# EAGLE schematic driver (EAGLE 9.4.2)
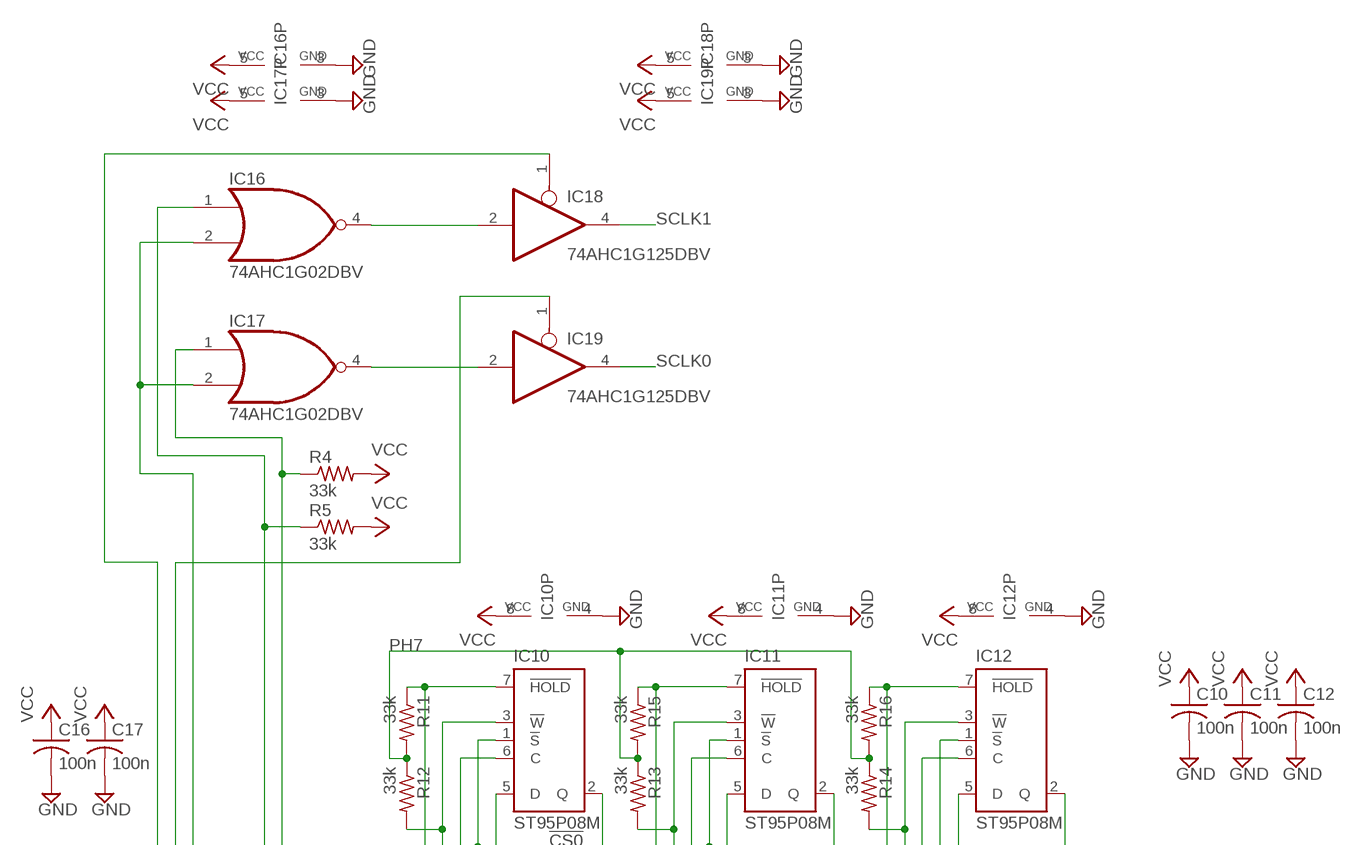
[diagram p0: schematic, sheet 1, part 1 of 2]
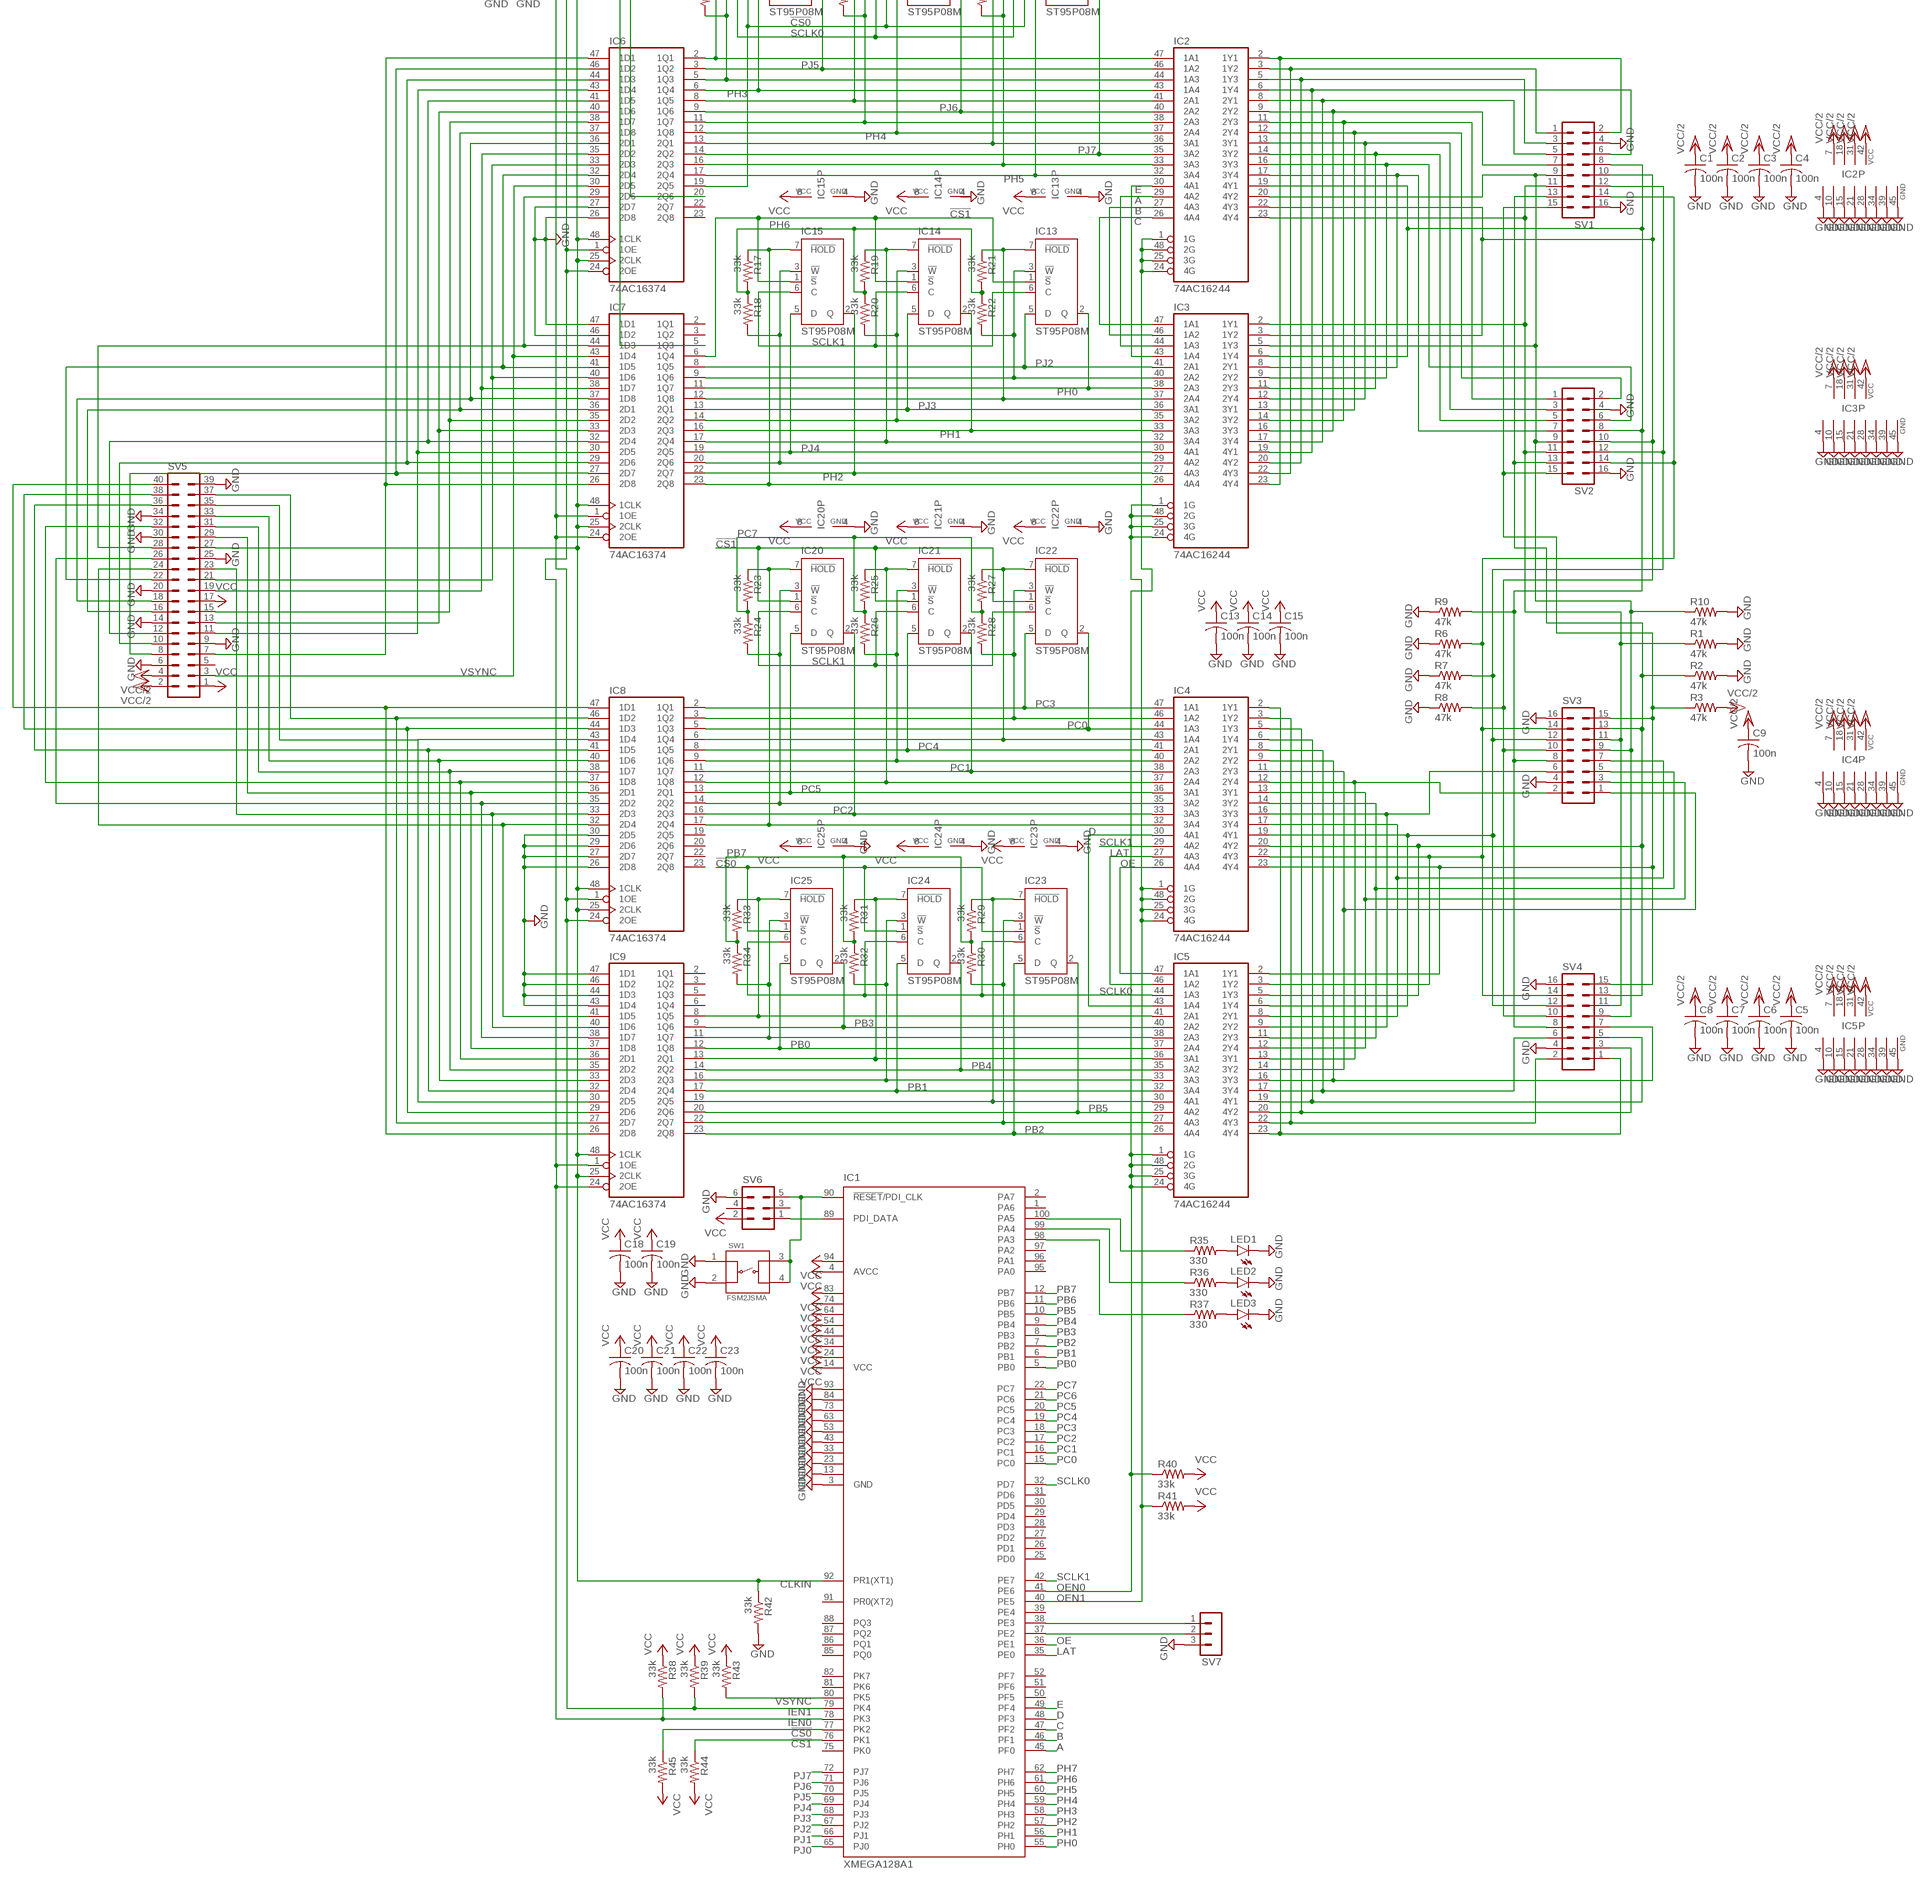
[diagram p1: schematic, sheet 1, part 2 of 2]

## Parts
C1  100n  C-USC0402  [C0402]
C2  100n  C-USC0402  [C0402]
C3  100n  C-USC0402  [C0402]
C4  100n  C-USC0402  [C0402]
C5  100n  C-USC0402  [C0402]
C6  100n  C-USC0402  [C0402]
C7  100n  C-USC0402  [C0402]
C8  100n  C-USC0402  [C0402]
C9  100n  C-USC0402  [C0402]
C10  100n  C-USC0402  [C0402]
C11  100n  C-USC0402  [C0402]
C12  100n  C-USC0402  [C0402]
C13  100n  C-USC0402  [C0402]
C14  100n  C-USC0402  [C0402]
C15  100n  C-USC0402  [C0402]
C16  100n  C-USC0402  [C0402]
C17  100n  C-USC0402  [C0402]
C18  100n  C-USC0402  [C0402]
C19  100n  C-USC0402  [C0402]
C20  100n  C-USC0402  [C0402]
C21  100n  C-USC0402  [C0402]
C22  100n  C-USC0402  [C0402]
C23  100n  C-USC0402  [C0402]
IC1  XMEGA128A1  [TQFP100]
IC2  74AC16244  [SSOP48DL]
IC3  74AC16244  [SSOP48DL]
IC4  74AC16244  [SSOP48DL]
IC5  74AC16244  [SSOP48DL]
IC6  74AC16374  [SSOP48DL]
IC7  74AC16374  [SSOP48DL]
IC8  74AC16374  [SSOP48DL]
IC9  74AC16374  [SSOP48DL]
IC10  ST95P08M  [SO08]
IC11  ST95P08M  [SO08]
IC12  ST95P08M  [SO08]
IC13  ST95P08M  [SO08]
IC14  ST95P08M  [SO08]
IC15  ST95P08M  [SO08]
IC16  74AHC1G02DBV  [SOT23-5]
IC17  74AHC1G02DBV  [SOT23-5]
IC18  74AHC1G125DBV  [SOT23-5]
IC19  74AHC1G125DBV  [SOT23-5]
IC20  ST95P08M  [SO08]
IC21  ST95P08M  [SO08]
IC22  ST95P08M  [SO08]
IC23  ST95P08M  [SO08]
IC24  ST95P08M  [SO08]
IC25  ST95P08M  [SO08]
LED1  LEDCHIPLED_0805  [CHIPLED_0805]
LED2  LEDCHIPLED_0805  [CHIPLED_0805]
LED3  LEDCHIPLED_0805  [CHIPLED_0805]
R1  47k  R-US_R0402  [R0402]
R2  47k  R-US_R0402  [R0402]
R3  47k  R-US_R0402  [R0402]
R4  33k  R-US_R0402  [R0402]
R5  33k  R-US_R0402  [R0402]
R6  47k  R-US_R0402  [R0402]
R7  47k  R-US_R0402  [R0402]
R8  47k  R-US_R0402  [R0402]
R9  47k  R-US_R0402  [R0402]
R10  47k  R-US_R0402  [R0402]
R11  33k  R-US_R0402  [R0402]
R12  33k  R-US_R0402  [R0402]
R13  33k  R-US_R0402  [R0402]
R14  33k  R-US_R0402  [R0402]
R15  33k  R-US_R0402  [R0402]
R16  33k  R-US_R0402  [R0402]
R17  33k  R-US_R0402  [R0402]
R18  33k  R-US_R0402  [R0402]
R19  33k  R-US_R0402  [R0402]
R20  33k  R-US_R0402  [R0402]
R21  33k  R-US_R0402  [R0402]
R22  33k  R-US_R0402  [R0402]
R23  33k  R-US_R0402  [R0402]
R24  33k  R-US_R0402  [R0402]
R25  33k  R-US_R0402  [R0402]
R26  33k  R-US_R0402  [R0402]
R27  33k  R-US_R0402  [R0402]
R28  33k  R-US_R0402  [R0402]
R29  33k  R-US_R0402  [R0402]
R30  33k  R-US_R0402  [R0402]
R31  33k  R-US_R0402  [R0402]
R32  33k  R-US_R0402  [R0402]
R33  33k  R-US_R0402  [R0402]
R34  33k  R-US_R0402  [R0402]
R35  330  R-US_R0402  [R0402]
R36  330  R-US_R0402  [R0402]
R37  330  R-US_R0402  [R0402]
R38  33k  R-US_R0402  [R0402]
R39  33k  R-US_R0402  [R0402]
R40  33k  R-US_R0402  [R0402]
R41  33k  R-US_R0402  [R0402]
R42  33k  R-US_R0402  [R0402]
R43  33k  R-US_R0402  [R0402]
R44  33k  R-US_R0402  [R0402]
R45  33k  R-US_R0402  [R0402]
SV1  MA08-2  [MA08-2]
SV2  MA08-2  [MA08-2]
SV3  MA08-2  [MA08-2]
SV4  MA08-2  [MA08-2]
SV5  MA20-2  [MA20-2]
SV6  MA03-2  [MA03-2]
SV7  MA03-1  [MA03-1]
SW1  FSM2JSMA  [FSM2JSMA]

## Nets
!CS0: IC1.77(PK2) IC6.19(2Q5) IC10.1(!S) IC11.1(!S) IC12.1(!S) IC23.1(!S) IC24.1(!S) IC25.1(!S) R45.1
!CS1: IC1.76(PK1) IC7.6(1Q4) IC13.1(!S) IC14.1(!S) IC15.1(!S) IC20.1(!S) IC21.1(!S) IC22.1(!S) R44.1
A: IC1.45(PF0) IC2.29(4A2) IC3.44(1A3)
B: IC1.46(PF1) IC2.27(4A3) IC3.46(1A2)
C: IC1.47(PF2) IC2.26(4A4) IC3.47(1A1)
CLKIN: IC1.92(PR1(XT1)) IC6.25(2CLK) IC6.48(1CLK) IC7.25(2CLK) IC7.48(1CLK) IC8.25(2CLK) IC8.48(1CLK) IC9.25(2CLK) IC9.48(1CLK) IC16.2(I1) IC17.2(I1) R42.1 SV5.27
D: IC1.48(PF3) IC4.30(4A1) IC5.43(1A4)
E: IC1.49(PF4) IC2.30(4A1) IC3.43(1A4)
GND: C1.2 C2.2 C3.2 C4.2 C5.2 C6.2 C7.2 C8.2 C9.2 C10.2 C11.2 C12.2 C13.2 C14.2 C15.2 C16.2 C17.2 C18.2 C19.2 C20.2 C21.2 C22.2 C23.2 IC1.3(GND) IC1.13(GND1) IC1.23(GND2) IC1.33(GND3) IC1.43(GND4) IC1.53(GND5) IC1.63(GND6) IC1.73(GND7) IC1.84(GND8) IC1.93(GND9) IC2.4(GND) IC2.10(GND) IC2.15(GND) IC2.21(GND) IC2.28(GND) IC2.34(GND) IC2.39(GND) IC2.45(GND) IC3.4(GND) IC3.10(GND) IC3.15(GND) IC3.21(GND) IC3.28(GND) IC3.34(GND) IC3.39(GND) IC3.45(GND) IC4.4(GND) IC4.10(GND) IC4.15(GND) IC4.21(GND) IC4.28(GND) IC4.34(GND) IC4.39(GND) IC4.45(GND) IC5.4(GND) IC5.10(GND) IC5.15(GND) IC5.21(GND) IC5.28(GND) IC5.34(GND) IC5.39(GND) IC5.45(GND) IC6.26(2D8) IC6.27(2D7) IC7.46(1D2) IC7.47(1D1) IC8.26(2D8) IC8.27(2D7) IC8.29(2D6) IC8.30(2D5) IC9.43(1D4) IC9.44(1D3) IC9.46(1D2) IC9.47(1D1) IC10.4(GND) IC11.4(GND) IC12.4(GND) IC13.4(GND) IC15.4(GND) IC16.3(GND) IC17.3(GND) IC18.3(GND) IC19.3(GND) IC20.4(GND) IC21.4(GND) IC22.4(GND) IC23.4(GND) IC24.4(GND) IC25.4(GND) LED1.C LED2.C LED3.C R1.2 R2.2 R6.1 R7.1 R8.1 R9.1 R10.2 R42.2 SV1.4 SV1.16 SV2.4 SV2.16 SV3.4 SV3.16 SV4.4 SV4.16 SV5.6 SV5.9 SV5.14 SV5.20 SV5.25 SV5.30 SV5.34 SV5.39 SV6.6 SV7.3 SW1.1 SW1.2
IEN0: IC1.78(PK3) IC6.1(1OE) IC6.24(2OE) IC9.1(1OE) IC9.24(2OE) IC19.1(OE) R38.2
IEN1: IC1.79(PK4) IC7.1(1OE) IC7.24(2OE) IC8.1(1OE) IC8.24(2OE) IC18.1(OE) R39.2
LAT: IC1.35(PE0) IC4.27(4A3) IC5.46(1A2)
N$1: IC2.2(1Y1) IC3.23(4Y4) SV1.2
N$2: IC2.3(1Y2) IC3.22(4Y3) SV1.1
N$3: IC2.6(1Y4) IC3.19(4Y1) SV1.6
N$4: IC2.5(1Y3) IC3.20(4Y2) SV1.3
N$5: IC2.8(2Y1) IC3.17(3Y4) SV1.5
N$6: IC2.9(2Y2) IC3.16(3Y3) SV1.7
N$7: IC2.12(2Y4) IC3.13(3Y1) SV2.2
N$8: IC2.14(3Y2) IC3.11(2Y3) SV2.5
N$9: IC2.13(3Y1) IC3.12(2Y4) SV2.3
N$10: IC2.16(3Y3) IC3.9(2Y2) SV2.6
N$11: IC2.19(4Y1) IC3.6(1Y4) R9.2 SV1.8 SV2.8 SV3.8 SV4.8
N$12: IC2.20(4Y2) IC3.5(1Y3) R10.1 SV1.9 SV2.9 SV3.9 SV4.9
N$13: IC2.11(2Y3) IC3.14(3Y2) SV2.1
N$14: IC2.23(4Y4) IC3.2(1Y1) R1.1 SV1.11 SV2.11 SV3.11 SV4.11
N$15: IC2.22(4Y3) IC3.3(1Y2) R8.2 SV1.10 SV2.10 SV3.10 SV4.10
N$17: IC4.19(4Y1) IC5.6(1Y4) R7.2 SV1.12 SV2.12 SV3.12 SV4.12
N$18: IC2.17(3Y4) IC3.8(2Y1) SV2.7
N$20: IC4.20(4Y2) IC5.5(1Y3) R2.1 SV1.13 SV2.13 SV3.13 SV4.13
N$21: IC4.23(4Y4) IC5.2(1Y1) R3.1 SV1.15 SV2.15 SV3.15 SV4.15
N$22: IC4.3(1Y2) IC5.22(4Y3) SV4.2
N$23: IC4.2(1Y1) IC5.23(4Y4) SV4.1
N$24: IC4.5(1Y3) IC5.20(4Y2) SV4.3
N$25: IC4.6(1Y4) IC5.19(4Y1) SV4.5
N$26: IC4.8(2Y1) IC5.17(3Y4) SV4.6
N$27: IC4.22(4Y3) IC5.3(1Y2) R6.2 SV1.14 SV2.14 SV3.14 SV4.14
N$28: IC4.9(2Y2) IC5.16(3Y3) SV4.7
N$29: IC2.47(1A1) IC6.2(1Q1) IC10.7(!HOLD) R11.1
N$30: IC6.32(2D4) IC7.41(1D5) SV5.22
N$31: IC2.44(1A3) IC6.5(1Q3) IC10.3(!W) R12.2
N$32: IC4.11(2Y3) IC5.14(3Y2) SV3.1
N$33: IC4.12(2Y4) IC5.13(3Y1) SV3.2
N$34: IC6.33(2D3) IC7.40(1D6) SV5.21
N$35: IC2.41(2A1) IC6.8(1Q5) IC11.7(!HOLD) R15.1
N$36: IC4.13(3Y1) IC5.12(2Y4) SV3.3
N$37: IC4.14(3Y2) IC5.11(2Y3) SV3.5
N$38: IC4.16(3Y3) IC5.9(2Y2) SV3.6
N$39: IC4.17(3Y4) IC5.8(2Y1) SV3.7
N$40: IC6.35(2D2) IC7.38(1D7) SV5.19
N$41: IC2.38(2A3) IC6.11(1Q7) IC11.3(!W) R13.2
N$42: IC16.4(O) IC18.2(I)
N$43: IC2.36(3A1) IC6.13(2Q1) IC12.7(!HOLD) R16.1
N$44: IC6.36(2D1) IC7.37(1D8) SV5.18
N$45: IC2.33(3A3) IC6.16(2Q3) IC12.3(!W) R14.2
N$46: IC17.4(O) IC19.2(I)
N$47: IC3.26(4A4) IC7.23(2Q8) IC15.7(!HOLD) R17.1
N$49: IC3.29(4A2) IC7.20(2Q6) IC15.3(!W) R18.2
N$50: IC6.37(1D8) IC7.36(2D1) SV5.16
N$51: IC3.32(3A4) IC7.17(2Q4) IC14.7(!HOLD) R19.1
N$52: IC6.38(1D7) IC7.35(2D2) SV5.15
N$53: IC3.35(3A2) IC7.14(2Q2) IC14.3(!W) R20.2
N$54: IC6.40(1D6) IC7.33(2D3) SV5.13
N$55: IC3.37(2A4) IC7.12(1Q8) IC13.7(!HOLD) R21.1
N$57: IC3.40(2A2) IC7.9(1Q6) IC13.3(!W) R22.2
N$58: IC6.41(1D5) IC7.32(2D4) SV5.12
N$59: IC6.43(1D4) IC7.30(2D5) SV5.11
N$60: IC6.44(1D3) IC7.29(2D6) SV5.10
N$61: IC6.46(1D2) IC7.27(2D7) SV5.8
N$62: IC6.47(1D1) IC7.26(2D8) SV5.7
N$63: IC1.90(!RESET!/PDI_CLK) SV6.5 SW1.3 SW1.4
N$64: IC4.46(1A2) IC8.3(1Q2) IC22.3(!W) R28.2
N$65: IC4.43(1A4) IC8.6(1Q4) IC22.7(!HOLD) R27.1
N$66: LED3.A R37.2
N$67: LED2.A R36.2
N$68: IC4.40(2A2) IC8.9(1Q6) IC21.3(!W) R26.2
N$69: LED1.A R35.2
N$70: IC4.37(2A4) IC8.12(1Q8) IC21.7(!HOLD) R25.1
N$71: IC1.100(PA5) R35.1
N$72: IC4.35(3A2) IC8.14(2Q2) IC20.3(!W) R24.2
N$73: IC1.99(PA4) R36.1
N$74: IC4.32(3A4) IC8.17(2Q4) IC20.7(!HOLD) R23.1
N$75: IC1.98(PA3) R37.1
N$76: IC5.27(4A3) IC9.22(2Q7) IC23.3(!W) R30.2
N$78: IC5.30(4A1) IC9.19(2Q5) IC23.7(!HOLD) R29.1
N$80: IC5.33(3A3) IC9.16(2Q3) IC24.3(!W) R32.2
N$82: IC5.36(3A1) IC9.13(2Q1) IC24.7(!HOLD) R31.1
N$84: IC5.38(2A3) IC9.11(1Q7) IC25.3(!W) R34.2
N$86: IC5.41(2A1) IC9.8(1Q5) IC25.7(!HOLD) R33.1
N$87: IC1.89(PDI_DATA) SV6.1
N$89: IC1.38(PE3) SV7.1
N$90: IC1.37(PE2) SV7.2
N$91: IC8.32(2D4) IC9.41(1D5) SV5.24
N$93: IC6.29(2D6) IC7.44(1D3) SV5.28
N$95: IC8.33(2D3) IC9.40(1D6) SV5.23
N$96: IC8.35(2D2) IC9.38(1D7) SV5.26
N$97: IC8.36(2D1) IC9.37(1D8) SV5.29
N$98: IC8.37(1D8) IC9.36(2D1) SV5.32
N$102: IC8.38(1D7) IC9.35(2D2) SV5.31
N$106: IC8.40(1D6) IC9.33(2D3) SV5.33
N$108: IC8.43(1D4) IC9.30(2D5) SV5.35
N$109: IC8.44(1D3) IC9.29(2D6) SV5.38
N$110: IC6.20(2Q6) IC17.1(I0) R4.1
N$111: IC8.46(1D2) IC9.27(2D7) SV5.37
N$112: IC8.47(1D1) IC9.26(2D8) SV5.40
N$113: IC7.5(1Q3) IC16.1(I0) R5.1
N$118: IC8.41(1D5) IC9.32(2D4) SV5.36
OE: IC1.36(PE1) IC4.26(4A4) IC5.47(1A1)
OEN0: IC1.41(PE6) IC2.1(1G) IC2.24(4G) IC2.25(3G) IC2.48(2G) IC5.1(1G) IC5.24(4G) IC5.25(3G) IC5.48(2G) R40.1
OEN1: IC1.40(PE5) IC3.1(1G) IC3.24(4G) IC3.25(3G) IC3.48(2G) IC4.1(1G) IC4.24(4G) IC4.25(3G) IC4.48(2G) R41.1
PB0: IC1.5(PB0) IC5.37(2A4) IC9.12(1Q8) IC25.5(D)
PB1: IC1.6(PB1) IC5.32(3A4) IC9.17(2Q4) IC24.5(D)
PB2: IC1.7(PB2) IC5.26(4A4) IC9.23(2Q8) IC23.5(D)
PB3: IC1.8(PB3) IC5.40(2A2) IC9.9(1Q6) IC25.2(Q)
PB4: IC1.9(PB4) IC5.35(3A2) IC9.14(2Q2) IC24.2(Q)
PB5: IC1.10(PB5) IC5.29(4A2) IC9.20(2Q6) IC23.2(Q)
PB6: IC1.11(PB6)
PB7: IC1.12(PB7) R29.2 R30.1 R31.2 R32.1 R33.2 R34.1
PC0: IC1.15(PC0) IC4.44(1A3) IC8.5(1Q3) IC22.2(Q)
PC1: IC1.16(PC1) IC4.38(2A3) IC8.11(1Q7) IC21.2(Q)
PC2: IC1.17(PC2) IC4.33(3A3) IC8.16(2Q3) IC20.2(Q)
PC3: IC1.18(PC3) IC4.47(1A1) IC8.2(1Q1) IC22.5(D)
PC4: IC1.19(PC4) IC4.41(2A1) IC8.8(1Q5) IC21.5(D)
PC5: IC1.20(PC5) IC4.36(3A1) IC8.13(2Q1) IC20.5(D)
PC6: IC1.21(PC6)
PC7: IC1.22(PC7) R23.2 R24.1 R25.2 R26.1 R27.2 R28.1
PH0: IC1.55(PH0) IC3.38(2A3) IC7.11(1Q7) IC13.2(Q)
PH1: IC1.56(PH1) IC3.33(3A3) IC7.16(2Q3) IC14.2(Q)
PH2: IC1.57(PH2) IC3.27(4A3) IC7.22(2Q7) IC15.2(Q)
PH3: IC1.58(PH3) IC2.43(1A4) IC6.6(1Q4) IC10.5(D)
PH4: IC1.59(PH4) IC2.37(2A4) IC6.12(1Q8) IC11.5(D)
PH5: IC1.60(PH5) IC2.32(3A4) IC6.17(2Q4) IC12.5(D)
PH6: IC1.61(PH6) R17.2 R18.1 R19.2 R20.1 R21.2 R22.1
PH7: IC1.62(PH7) R11.2 R12.1 R13.1 R14.1 R15.2 R16.2
PJ0: IC1.65(PJ0)
PJ1: IC1.66(PJ1)
PJ2: IC1.67(PJ2) IC3.41(2A1) IC7.8(1Q5) IC13.5(D)
PJ3: IC1.68(PJ3) IC3.36(3A1) IC7.13(2Q1) IC14.5(D)
PJ4: IC1.69(PJ4) IC3.30(4A1) IC7.19(2Q5) IC15.5(D)
PJ5: IC1.70(PJ5) IC2.46(1A2) IC6.3(1Q2) IC10.2(Q)
PJ6: IC1.71(PJ6) IC2.40(2A2) IC6.9(1Q6) IC11.2(Q)
PJ7: IC1.72(PJ7) IC2.35(3A2) IC6.14(2Q2) IC12.2(Q)
SCLK0: IC1.32(PD7) IC5.44(1A3) IC10.6(C) IC11.6(C) IC12.6(C) IC19.4(O) IC23.6(C) IC24.6(C) IC25.6(C)
SCLK1: IC1.42(PE7) IC4.29(4A2) IC13.6(C) IC14.6(C) IC15.6(C) IC18.4(O) IC20.6(C) IC21.6(C) IC22.6(C)
VCC: C10.1 C11.1 C12.1 C13.1 C14.1 C15.1 C16.1 C17.1 C18.1 C19.1 C20.1 C21.1 C22.1 C23.1 IC1.4(AVCC) IC1.14(VCC) IC1.24(VCC1) IC1.34(VCC2) IC1.44(VCC3) IC1.54(VCC4) IC1.64(VCC5) IC1.74(VCC6) IC1.83(VCC7) IC1.94(AVCC1) IC10.8(VCC) IC11.8(VCC) IC12.8(VCC) IC13.8(VCC) IC14.8(VCC) IC15.8(VCC) IC16.5(VCC) IC17.5(VCC) IC18.5(VCC) IC19.5(VCC) IC20.8(VCC) IC21.8(VCC) IC22.8(VCC) IC23.8(VCC) IC24.8(VCC) IC25.8(VCC) R4.2 R5.2 R38.1 R39.1 R40.2 R41.2 R43.1 R44.2 R45.2 SV5.1 SV5.17 SV6.2
VCC/2: C1.1 C2.1 C3.1 C4.1 C5.1 C6.1 C7.1 C8.1 C9.1 IC2.7(VCC) IC2.18(VCC) IC2.31(VCC) IC2.42(VCC) IC3.7(VCC) IC3.18(VCC) IC3.31(VCC) IC3.42(VCC) IC4.7(VCC) IC4.18(VCC) IC4.31(VCC) IC4.42(VCC) IC5.7(VCC) IC5.18(VCC) IC5.31(VCC) IC5.42(VCC) R3.2 SV5.2 SV5.4
VSYNC: IC1.80(PK5) IC6.30(2D5) IC7.43(1D4) R43.2 SV5.3
Unconnected: IC1.1(PA6) IC1.2(PA7) IC1.25(PD0) IC1.26(PD1) IC1.27(PD2) IC1.28(PD3) IC1.29(PD4) IC1.30(PD5) IC1.31(PD6) IC1.39(PE4) IC1.50(PF5) IC1.51(PF6) IC1.52(PF7) IC1.75(PK0) IC1.81(PK6) IC1.82(PK7) IC1.85(PQ0) IC1.86(PQ1) IC1.87(PQ2) IC1.88(PQ3) IC1.91(PR0(XT2)) IC1.95(PA0) IC1.96(PA1) IC1.97(PA2) IC6.22(2Q7) IC6.23(2Q8) IC7.2(1Q1) IC7.3(1Q2) IC8.19(2Q5) IC8.20(2Q6) IC8.22(2Q7) IC8.23(2Q8) IC9.2(1Q1) IC9.3(1Q2) IC9.5(1Q3) IC9.6(1Q4) SV5.5 SV6.3 SV6.4

## Power pins joined to a net without a drawn wire
GND: IC6.4(GND) IC6.10(GND) IC6.15(GND) IC6.21(GND) IC6.28(GND) IC6.34(GND) IC6.39(GND) IC6.45(GND) IC7.4(GND) IC7.10(GND) IC7.15(GND) IC7.21(GND) IC7.28(GND) IC7.34(GND) IC7.39(GND) IC7.45(GND) IC8.4(GND) IC8.10(GND) IC8.15(GND) IC8.21(GND) IC8.28(GND) IC8.34(GND) IC8.39(GND) IC8.45(GND) IC9.4(GND) IC9.10(GND) IC9.15(GND) IC9.21(GND) IC9.28(GND) IC9.34(GND) IC9.39(GND) IC9.45(GND) IC14.4(GND)
VCC: IC6.7(VCC) IC6.18(VCC) IC6.31(VCC) IC6.42(VCC) IC7.7(VCC) IC7.18(VCC) IC7.31(VCC) IC7.42(VCC) IC8.7(VCC) IC8.18(VCC) IC8.31(VCC) IC8.42(VCC) IC9.7(VCC) IC9.18(VCC) IC9.31(VCC) IC9.42(VCC)

## Library data of the parts
C1-C23 = rcl:C-US: CAPACITOR, American symbol; SPICEPREFIX: C
IC1 = atmel:XMEGA128A1: MICROCONTROLLER Features High-performance, Low-power 8/16-bit AVR XMEGA Microcontroller Non-Volatile Program and Data Memories - 64K - 384K Bytes of In-System Self-Programmable Flash - 4K - 8K Bytes Boot Section with Independent Lock Bits - 2 KB - 4 KB EEPROM - 4 KB - 32 KB Internal SRAM External Bus Interface for up to 16M bytes SRAM External Bus Interface for up to 128M bit SDRAM Peripheral Features - Four-channel DMA Controller with support for external requests - Eight-channel Event System - Eight 16-bit Timer/Counters Four Timer/Counters with 4 Output Compare or Input Capture channels Four Timer/Counters with 2 Output Compare or Input Capture channels High-Resolution Extension on all Timer/Counters Advanced Waveform Extension on two Timer/Counters - Eight USARTs IrDA modulation/demodulation for one USART - Four Two-Wire Interfaces with dual address match (I2C and SMBus compatible) - Four SPI (Serial Peripheral Interface) peripherals - AES and DES Crypto Engine - 16-bit Real Time Counter with separate Oscillator - Two Eight-channel, 12-bit, 2 Msps Analog to Digital Converters - Two Two-channel, 12-bit, 1 Msps Digital to Analog Converters - Four Analog Comparators with Window compare function - External Interrupts on all General Purpose I/O pins - Programmable Watchdog Timer with Separate On-chip Ultra Low Power Oscillator Special Microcontroller Features - Power-on Reset and Programmable Brown-out Detection - Internal and External Clock Options with PLL and Prescaler - Programmable Multi-level Interrupt Controller - Sleep Modes: Idle, Power-down, Standby, Power-save, Extended Standby - Advanced Programming, Test and Debugging Interfaces JTAG (IEEE 1149.1 Compliant) Interface for programming, test and debugging PDI (Program and Debug Interface) for programming and debugging I/O and Packages - 78 Programmable I/O Lines - 100 - lead TQFP - 100 - ball CBGA - 100 - ball VFBGA Operating Voltage - 1.6 - 3.6V Speed performance - 0 - 12 MHz @ 1.6 - 3.6V - 0 - 32 MHz @ 2.7 - 3.6V Drawn by Dipl.-Ing. (FH) Robert Siegler Created: 27.05.09; OC_FARNELL: unknown; OC_NEWARK: unknown
IC2-IC5 = 74ac-logic:74AC16244: 16-bit BUFFER/LINE DRIVER, 3-state
IC6-IC9 = 74ac-logic:74AC16374: 16-bit edge-triggered D-type FLIP FLOP, 3-state
IC10-IC15 IC20-IC25 = st-microelectronics:ST95P08M: Serial EEPROM SPI bus, 1 K x 8; OC_FARNELL: unknown; OC_NEWARK: unknown
IC16 IC17 = 74xx-little-us:74*1G02: 2-input NOR gate
IC18 IC19 = 74xx-little-us:74*1G125: Single Bus Buffer Gate with 3-State Output
LED1-LED3 = led:LED: LED OSRAM: - CHIPLED LG R971, LG N971, LY N971, LG Q971, LY Q971, LO R971, LY R971 LH N974, LH R974 LS Q976, LO Q976, LY Q976 LO Q996 - Hyper CHIPLED LW Q18S LB Q993, LB Q99A, LB R99A - SideLED LS A670, LO A670, LY A670, LG A670, LP A670 LB A673, LV A673, LT A673, LW A673 LH A674 LY A675 LS A676, LA A676, LO A676, LY A676, LW A676 LS A679, LY A679, LG A679 - Hyper Micro SIDELED® LS Y876, LA Y876, LO Y876, LY Y876 LT Y87S - SmartLED LW L88C, LW L88S LB L89C, LB L89S, LG L890 LS L89K, LO L89K, LY L89K LS L896, LA L896, LO L896, LY L896 - TOPLED LS T670, LO T670, LY T670, LG T670, LP T670 LSG T670, LSP T670, LSY T670, LOP T670, LYG T670 LG T671, LOG T671, LSG T671 LB T673, LV T673, LT T673, LW T673 LH T674 LS T676, LA T676, LO T676, LY T676, LB T676, LH T676, LSB T676, LW T676 LB T67C, LV T67C, LT T67C, LS T67K, LO T67K, LY T67K, LW E67C LS E67B, LA E67B, LO E67B, LY E67B, LB E67C, LV E67C, LT E67C LW T67C LS T679, LY T679, LG T679 LS T770, LO T770, LY T770, LG T770, LP T770 LB T773, LV T773, LT T773, LW T773 LH T774 LS E675, LA E675, LY E675, LS T675 LS T776, LA T776, LO T776, LY T776, LB T776 LHGB T686 LT T68C, LB T68C - Hyper Mini TOPLED® LB M676 - Mini TOPLED Santana® LG M470 LS M47K, LO M47K, LY M47K Source: http://www.osram.convergy.de LUXEON: - LUMILED® LXK2-PW12-R00, LXK2-PW12-S00, LXK2-PW14-U00, LXK2-PW14-V00 LXK2-PM12-R00, LXK2-PM12-S00, LXK2-PM14-U00 LXK2-PE12-Q00, LXK2-PE12-R00, LXK2-PE12-S00, LXK2-PE14-T00, LXK2-PE14-U00 LXK2-PB12-K00, LXK2-PB12-L00, LXK2-PB12-M00, LXK2-PB14-N00, LXK2-PB14-P00, LXK2-PB14-Q00 LXK2-PR12-L00, LXK2-PR12-M00, LXK2-PR14-Q00, LXK2-PR14-R00 LXK2-PD12-Q00, LXK2-PD12-R00, LXK2-PD12-S00 LXK2-PH12-R00, LXK2-PH12-S00 LXK2-PL12-P00, LXK2-PL12-Q00, LXK2-PL12-R00 Source: www.luxeon.com KINGBRIGHT: KA-3528ASYC Source: www.kingbright.com
R1-R45 = rcl:R-US_: RESISTOR, American symbol; SPICEPREFIX: R
SV1-SV4 = con-lstb:MA08-2: PIN HEADER; OC_FARNELL: unknown; OC_NEWARK: unknown
SV5 = con-lstb:MA20-2: PIN HEADER; OC_FARNELL: unknown; OC_NEWARK: unknown
SV6 = con-lstb:MA03-2: PIN HEADER; OC_FARNELL: unknown; OC_NEWARK: unknown
SV7 = con-lstb:MA03-1: PIN HEADER; OC_FARNELL: unknown; OC_NEWARK: unknown
SW1 = Switch:FSM2JSMA: SWITCH TACTILE SPST-NO 0.05A 24V Manufacturer's datasheet <https://www.te.com/commerce/DocumentDelivery/DDEController?Action=srchrtrv&DocNm=2-1437565-7&DocType=Customer+Drawing&DocLang=English>; CREATED_BY: PCBLayout.com; DIGIKEY_PART_NUMBER: 450-1130-ND; MANUFACTURER: TE Connectivity ALCOSWITCH Switches; MPN: FSM2JSMA